# Altium schematic sheet 百味勺子.SchDoc
size A4
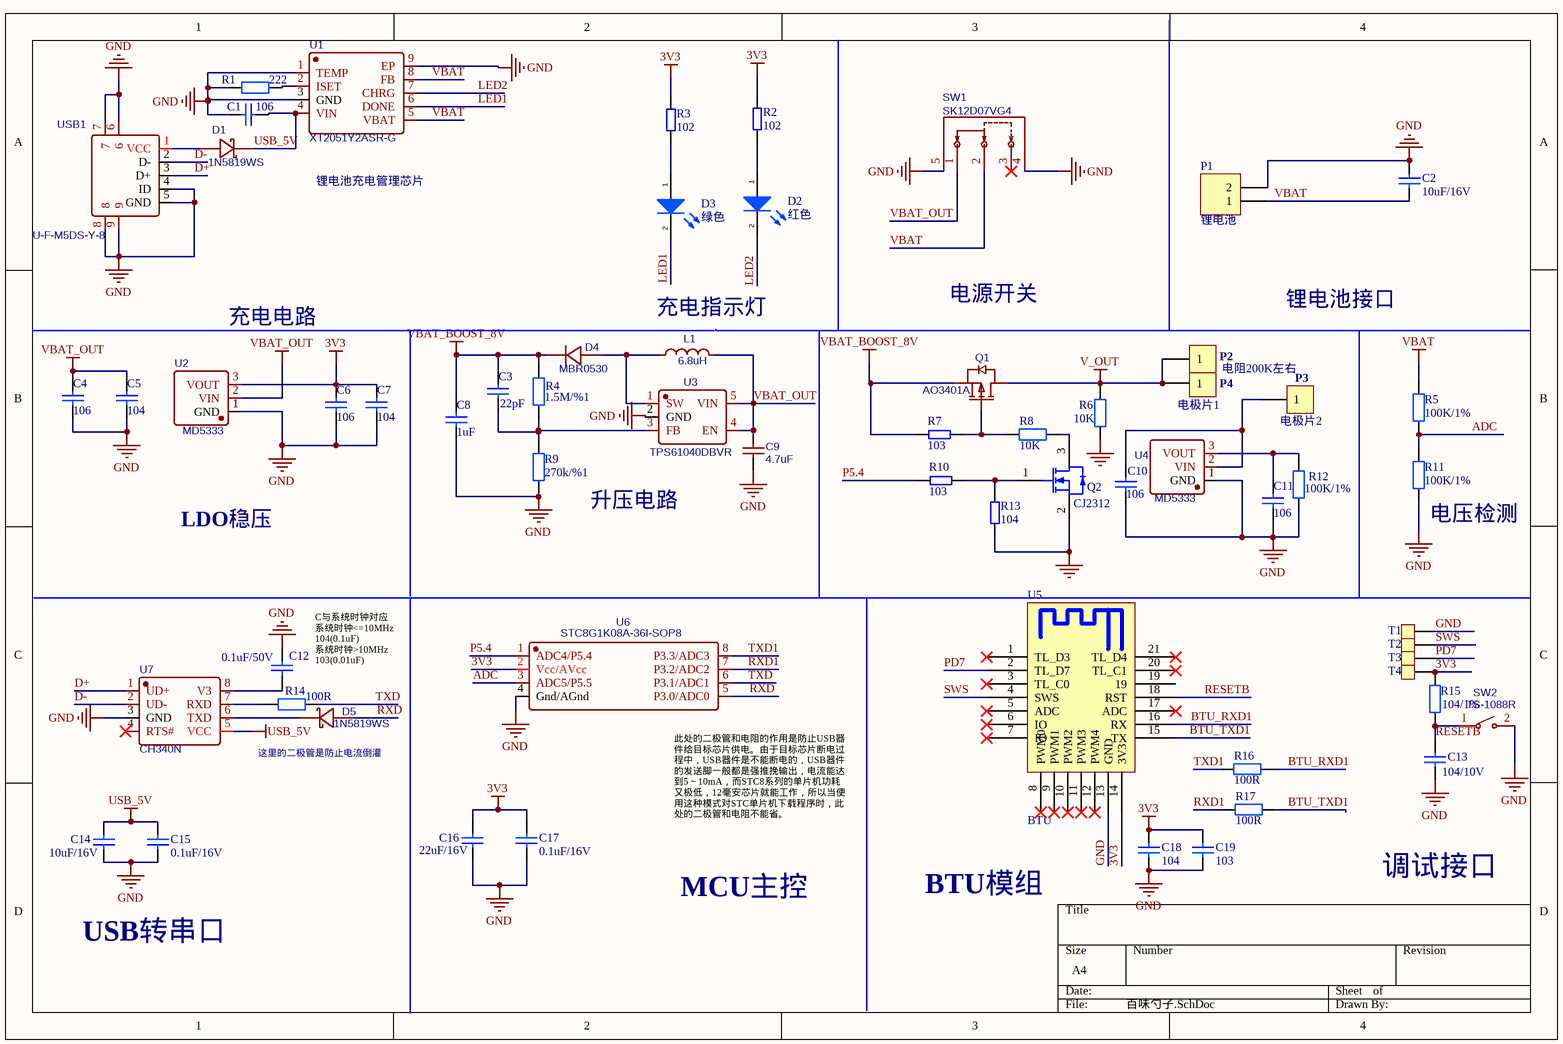
[diagram p0: 百味勺子.SchDoc]

## Parts
C1  106  [C0603]
C2  10uF/16V  [C0603]
C3  22pF  [C0402]
C4  106  [C0603]
C5  104  [C0402]
C6  106  [C0603]
C7  104  [C0402]
C8  1uF  [C0603]
C9  4.7uF  [JMK212BJ475KG-T]
C10  106  [C0603]
C11  106  [C0603]
C12  0.1uF/50V  [C0402]
C13  104/10V  [C0402]
C14  10uF/16V  [C0603]
C15  0.1uF/16V  [C0402]
C16  22uF/16V  [C0603]
C17  0.1uF/16V  [C0402]
C18  104  [C0402]
C19  103  [C0402]
D1  1N5819WS  [1N5819WS]
D2  红色  [OSR50603C1E]
D3  绿色  [OSR50603C1E]
D4  MBR0530  [MBR0530]
D5  1N5819WS  [1N5819WS]
L1  6.8uH  [CDRH3D23NP-6R8PC]
P1  锂电池  [HDR1X2]
P2  CON1  [焊点1]  (value not drawn)
P3  CON1  [焊点1]  (value not drawn)
P4  CON1  [焊点1]  (value not drawn)
Q1  AO3401A  [AO3401A]
Q2  CJ2312  [CJ2312]
R1  222  [R0402]
R2  102  [R0402]
R3  102  [R0402]
R4  1.5M/%1  [R0402]
R5  100K/1%  [R0402]
R6  10K  [R0402]
R7  103  [R0402]
R8  10K  [R0402]
R9  270k/%1  [R0402]
R10  103  [R0402]
R11  100K/1%  [R0402]
R12  100K/1%  [R0402]
R13  104  [R0402]
R14  100R  [R0402]
R15  104/1%  [R0402]
R16  100R  [R0402]
R17  100R  [R0402]
SW1  SK12D07VG4  [SK12D07VG4]
SW2  TS-1088R  [TS-1088R-02026]
T1  TP  [TP1]  (value not drawn)
T2  TP  [TP1]  (value not drawn)
T3  TP  [TP1]  (value not drawn)
T4  TP  [TP1]  (value not drawn)
U1  XT2051Y2ASR-G  [XT2051Y2ASR-G]
U2  MD5333  [MD5333]
U3  TPS61040DBVR  [TPS61040DBVR]
U4  MD5333  [MD5333]
U5  BTU  [CBU1]
U6  STC8G1K08A-36I-SOP8  [STC8G1K08A-36I-SOP8]
U7  CH340N  [CH340N]
USB1  U-F-M5DS-Y-8  [U-F-M5DS-Y-8]

## Nets
3V3: C6.1 C7.1 C16.2 C17.2 C18.1 C19.1 R2.2 R3.2 R15.2 T4.1 U2.3(VOUT) U5.14(3V3) U6.2(Vcc/AVcc)
GND: C1.2 C2.1 C4.2 C5.2 C6.2 C7.2 C8.2 C9.1 C10.2 C11.2 C12.2 C13.2 C14.1 C15.1 C16.1 C17.1 C18.2 C19.2 P1.2 Q2.2(S) R1.2 R6.2 R9.1 R11.1 R12.1 R13.1 SW1.4 SW1.5 SW2.2 T1.1 U1.1(TEMP) U1.3(GND) U1.9(EP) U2.1(GND) U3.2(GND) U4.1(GND) U5.13(GND) U6.4(Gnd/AGnd) U7.3(GND) USB1.4(ID) USB1.5(GND) USB1.6 USB1.7 USB1.8 USB1.9
USB_5V: C1.1 C14.2 C15.2 D1.1(C) U1.4(VIN) U7.5(VCC)
V_OUT: P2.1 P4.1 Q1.3(D) R6.1
VBAT: C2.2 P1.1 R5.2 SW1.2 U1.5(VBAT) U1.8(FB)
VBAT_BOOST_8V: C3.1 C8.1 D4.1(K) Q1.2(S) R4.2 R7.1
VBAT_OUT: C4.1 C5.1 C9.2 L1.2 SW1.1 U2.2(VIN) U3.4(EN) U3.5(VIN)
ADC: R5.1 R11.2 U6.3(ADC5/P5.5)
BTU_RXD1: R16.1 U5.16(RX)
BTU_TXD1: R17.1 U5.15(TX)
D+: U7.1(UD+) USB1.3(D+)
D-: U7.2(UD-) USB1.2(D-)
LED1: D3.2 U1.6(DONE)
LED2: D2.2 U1.7(CHRG)
P5.4: R10.1 U6.1(ADC4/P5.4)
PD7: T3.1 U5.2(TL_D7)
RESETB: C13.1 R15.1 SW2.1 U5.18(RST)
RXD: D5.2(A) U6.5(P3.0/ADC0)
RXD1: R17.2 U6.7(P3.2/ADC2)
SWS: T2.1 U5.4(SWS)
TXD: R14.2 U6.6(P3.1/ADC1)
TXD1: R16.2 U6.8(P3.3/ADC3)
NetC3_2: C3.2 R4.1 R9.2 U3.3(FB)
NetC10_1: C10.1 P3.1 U4.2(VIN)
NetC11_1: C11.1 R12.2 U4.3(VOUT)
NetC12_1: C12.1 U7.8(V3)
NetD1_2: D1.2(A) USB1.1(VCC)
NetD2_1: D2.1 R2.1
NetD3_1: D3.1 R3.1
NetD4_2: D4.2(A) L1.1 U3.1(SW)
NetD5_1: D5.1(C) U7.6(TXD)
NetQ1_1: Q1.1(G) R7.2 R8.1
NetQ2_1: Q2.1(G) R10.2 R13.2
NetQ2_3: Q2.3(D) R8.2
NetR1_1: R1.1 U1.2(ISET)
NetR14_1: R14.1 U7.7(RXD)

Not connected (* = marked no-connect by the designer): SW1 3*; U5 1(TL_D3)* 3(TL_C0)* 5(ADC)* 6(IO)* 7(IO)* 8(PWM0)* 9(PWM1)* 10(PWM2)* 11(PWM3)* 12(PWM4)* 17(ADC)* 19 20(TL_C1)* 21(TL_D4)*; U7 4(RTS#)*

## Notes on the sheet
- 锂电池充电管理芯片
- (near L1) 充电指示灯
- 电源开关
- 锂电池接口
- 充电电路
- 电阻200K左右
- (near P4) 电极片1
- (near P3) 电极片2
- LDO稳压
- 升压电路
- (near R11) 电压检测
- C与系统时钟对应
  系统时钟<=10MHz
  104(0.1uF)
  系统时钟>10MHz
  103(0.01uF)
- 这里的二极管是防止电流倒灌
- (near U6) 此处的二极管和电阻的作用是防止USB器件给目标芯片供电。由于目标芯片断电过程中，USB器件是不能断电的，USB器件的发送脚一般都是强推挽输出，电流能达到5～10mA，而STC8系列的单片机功耗又极低，12毫安芯片就能工作，所以当使用这种模式对STC单片机下载程序时，此处的二极管和电阻不能省。
- MCU主控
- BTU模组
- 调试接口
- USB转串口

## Library data of the parts
C1 C14 C16 = 1.02.03.00181: 无极性电容; Value: 1uF/16V; 物料通用性等级: 高; 工作温度: null; 物料描述: 瓷介电容;贴片;X7R;1UF;±10%;16V;0603; 制造商: 三星(SAMSUNG); 制造商型号: CL10B105KO8NNNC; Orcad Library: #N/A; 管脚数量: 2; 安装方式: 贴片; 物料类目: 瓷介电容; 物料状态: 已发布; 修改人: system; 物料生产状态: 量产; Part Number: 1.02.03.00181; ComponentLink2Description: 三星MLCC.pdf; ComponentLink2URL: file:///\\172.16.246.8\lib-ad\DBlib\Datasheet\电容类资料\三星MLCC.pdf; Orcad Library Path: #N/A; Orcad Footprint: #N/A; Orcad Footprint Path: #N/A; 器件高度: null; 更新时间: 2021-03-25 10:51:02; ALT_SYMBOLS: #N/A
C2 = Capacitor - non polarized: 无极性电容; Part Number: 1.02.05.00869
C3-C8 C10 C11 C13 C18 C19 = 1.02.05.00869: 无极性电容; Part Number: 1.02.05.00869
C9 = 4.7uF: BOM_Manufacturer: TAIYO YUDEN; nameAlias: Capacitance; BOM_Supplier: LCSC; BOM_Manufacturer Part: JMK212BJ475KG-T; BOM_Supplier Part: C92788; spicePre: C; spiceSymbolName: JMK212BJ475KG-T
C12 = 1.02.05.00834: 无极性电容; 物料通用性等级: 高; 工作温度: null; 物料描述: 瓷介电容;贴片;X7R;0.1UF;±10%;50V;0603; 制造商: 华科; 制造商型号: 0603B104K500CT; Orcad Library: C; Orcad Library Path: Z:\tuya_lib\sch-lib\DISCRETE.OLB; Orcad Footprint: c0603,c0603a; Orcad Footprint Path: Z:\tuya_lib\footprint; 管脚数量: 2; 安装方式: 贴片; 物料类目: 瓷介电容; 物料状态: 已发布; 修改人: system; 物料生产状态: 量产; Part Number: 1.02.05.00834; Value: 0.1uF/50V; ComponentLink2Description: null; ComponentLink2URL: null; 器件高度: null; 更新时间: 2021-03-25 10:51:02; ALT_SYMBOLS: c0603,c0603a
C15 C17 = 1.02.05.00834: 无极性电容; Value: 0.1uF/50V; 物料通用性等级: 高; 工作温度: null; 物料描述: 瓷介电容;贴片;X7R;0.1UF;±10%;50V;0603; 制造商: 华科; 制造商型号: 0603B104K500CT; Orcad Library: C; Orcad Library Path: Z:\tuya_lib\sch-lib\DISCRETE.OLB; Orcad Footprint: c0603,c0603a; Orcad Footprint Path: Z:\tuya_lib\footprint; 管脚数量: 2; 安装方式: 贴片; 物料类目: 瓷介电容; 物料状态: 已发布; 修改人: system; 物料生产状态: 量产; Part Number: 1.02.05.00834; ComponentLink2Description: null; ComponentLink2URL: null; 器件高度: null; 更新时间: 2021-03-25 10:51:02; ALT_SYMBOLS: c0603,c0603a
D1 D5 = 1N5819WS_C1884554: BOM_Manufacturer: YFW佑风微; Contributor: LCSC; BOM_Supplier: LCSC; BOM_Supplier Part: C1884554; BOM_Manufacturer Part: 1N5819WS; BOM_JLCPCB Part Class: Extended Part; spicePre: D; spiceSymbolName: 1N5819WS_C1884554
D2 D3 = LED: Part Number: 1.06.02.00452
D4 = MBR0530_C475718: BOM_Manufacturer: Shikues; Contributor: LCSC; BOM_Supplier: LCSC; BOM_Supplier Part: C475718; BOM_Manufacturer Part: MBR0530; BOM_JLCPCB Part Class: Extended Part; spicePre: D; spiceSymbolName: MBR0530_C475718
L1 = 6.8uH: BOM_Manufacturer: Sumida; nameAlias: Inductance; Contributor: LCSC; BOM_Supplier: LCSC; BOM_Supplier Part: C323532; BOM_Manufacturer Part: CDRH3D23NP-6R8PC; spicePre: L; spiceSymbolName: CDRH3D23NP-6R8PC
P1 = Header 2: Header, 2-Pin; LatestRevisionDate: 17-Jul-2002; LatestRevisionNote: Re-released for DXP Platform.; Publisher: Altium Limited
Q1 = AO3401A_C700954: BOM_Manufacturer: HUASHUO(华朔); Contributor: LCSC; BOM_Supplier: LCSC; BOM_Supplier Part: C700954; BOM_Manufacturer Part: AO3401A; BOM_JLCPCB Part Class: Extended Part; spicePre: Q; spiceSymbolName: AO3401A_C700954
Q2 = 1.06.11.00008: N-Channel MOSFET; 物料通用性等级: 高; 工作温度: null; 物料描述: 场效应管;N沟道;CJ2312;20V;5A;31.8MR/4.5V;SOT-23;贴片; 制造商: 江苏长电; Orcad Library: FETN_GSD; Orcad Library Path: ‪Z:\tuya_lib\sch-lib\DISCRETE.OLB; Orcad Footprint: sot23-3; Orcad Footprint Path: Z:\tuya_lib\footprint; 管脚数量: 3; 器件高度: 1.15mm; 安装方式: 贴片; 物料类目: 场效应管; 物料状态: 已发布; 修改人: system; 物料生产状态: 量产; Part Number: 1.06.11.00008; Value: CJ2312; ComponentLink2Description: CJ2312.pdf; ComponentLink2URL: file:///\\172.16.246.8\lib-ad\DBlib\Datasheet\三极管资料\CJ2312.pdf; 制造商型号: CJ2312; 更新时间: 2021-03-25 10:51:02
R1 R15-R17 = 1.01.01.00808: 电阻; Part Number: 1.01.01.00808
R2 R3 R7 R10 R13 = RES-1: RES
R4-R6 R8 R9 R11 R12 = 100K/1%: 电阻; Value: 100K/1%
R14 = 1.01.01.00808: 电阻; Value: 200R; 物料通用性等级: 中; 工作温度: null; 物料描述: 普通电阻;200R;±5%;0603;1/10W;贴片;; 制造商: 厚声(UniOhm); 制造商型号: 0603WAJ0201***; Orcad Library: R; Orcad Library Path: Z:\tuya_lib\sch-lib\DISCRETE.OLB; Orcad Footprint: r0603; Orcad Footprint Path: Z:\tuya_lib\footprint; 管脚数量: 2; 安装方式: 贴片; 物料类目: 普通电阻; 物料状态: 已发布; 修改人: system; 物料生产状态: 量产; Part Number: 1.01.01.00808; ComponentLink2Description: 厚生电阻规格书.pdf; ComponentLink2URL: file:///\\172.16.246.8\lib-ad\DBlib\Datasheet\电阻类\厚生电阻规格书.pdf; 器件高度: null; 更新时间: 2021-03-25 10:51:02; ALT_SYMBOLS: r0603
SW1 = SK12D07VG4: BOM_Manufacturer: SHOU HAN; Contributor: LCSC; BOM_Supplier: LCSC; BOM_Supplier Part: C393937; BOM_Manufacturer Part: SK12D07VG4; BOM_JLCPCB Part Class: Extended Part; spicePre: S; spiceSymbolName: SK12D07VG4
SW2 = TS-1088R-02026: BOM_Manufacturer: XUNPU; Contributor: LCSC; BOM_Paste Type: expand; BOM_Supplier: LCSC; BOM_Supplier Part: C455280; BOM_Manufacturer Part: TS-1088R-02026; spicePre: S; spiceSymbolName: TS-1088R-02026
U1 = XT2051Y2ASR-G: BOM_Manufacturer: NATLINEAR; Contributor: LCSC; BOM_Supplier: LCSC; BOM_Supplier Part: C236398; BOM_Manufacturer Part: XT2051Y2ASR-G; spicePre: U; spiceSymbolName: XT2051Y2ASR-G
U2 U4 = MD5333: BOM_Manufacturer: 明达微; Contributor: LCSC; BOM_Supplier: LCSC; BOM_Supplier Part: C2827936; BOM_Manufacturer Part: MD5333; BOM_JLCPCB Part Class: Extended Part; spicePre: U; spiceSymbolName: MD5333
U3 = TPS61040DBVR: BOM_Manufacturer: TI; BOM_Supplier: LCSC; BOM_Manufacturer Part: TPS61040DBVR; BOM_Supplier Part: C7722; BOM_JLCPCB Part Class: Basic Part; spicePre: U; spiceSymbolName: TPS61040DBVR
U5 = CBU: Part Number: 0110; 制造商: 涂鸦; Process: 贴片; Value: CBU; Component Type: Standard; 描述: CBU; 制造商型号: CBU; Pin Count: 21
U6 = STC8G1K08A-36I-SOP8: BOM_Manufacturer: STC Micro; Contributor: LCSC; BOM_Supplier: LCSC; BOM_Supplier Part: C915663; BOM_Manufacturer Part: STC8G1K08A-36I-SOP8; BOM_JLCPCB Part Class: Extended Part; spicePre: U; spiceSymbolName: STC8G1K08A-36I-SOP8
U7 = CH340N: BOM_Manufacturer: WCH(Jiangsu Qin Heng); Contributor: LCSC; BOM_Paste Type: expand; BOM_Supplier: LCSC; BOM_Supplier Part: C506813; BOM_Manufacturer Part: CH340N; spicePre: U; spiceSymbolName: CH340N
USB1 = U-F-M5DS-Y-8: BOM_Manufacturer: Korean Hroparts Elec; Contributor: LCSC; BOM_Supplier: LCSC; BOM_Supplier Part: C961761; BOM_Manufacturer Part: U-F-M5DS-Y-8; spicePre: U; spiceSymbolName: U-F-M5DS-Y-8